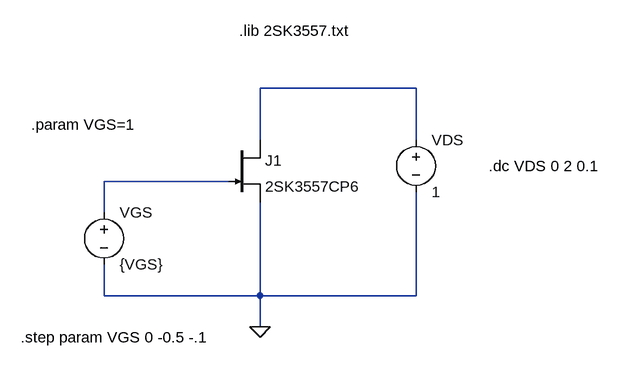
[diagram p0: schematic njfet_2sk3557.asc]
njfet_2sk3557.asc, the LTspice schematic file:
Version 4
SHEET 1 1024 680
WIRE 432 -16 192 -16
WIRE 192 64 192 -16
WIRE 432 64 432 -16
WIRE 144 128 -48 128
WIRE -48 176 -48 128
WIRE -48 304 -48 256
WIRE 192 304 192 160
WIRE 192 304 -48 304
WIRE 432 304 432 144
WIRE 432 304 192 304
WIRE 192 352 192 304
FLAG 192 352 0
SYMBOL voltage -48 160 R0
SYMATTR InstName VGS
SYMATTR Value {VGS}
SYMBOL voltage 432 48 R0
SYMATTR InstName VDS
SYMATTR Value 1
SYMBOL njf 144 64 R0
SYMATTR InstName J1
SYMATTR Value 2SK3557CP6
SYMATTR Prefix X
TEXT 160 -104 Left 2 !.lib 2SK3557.txt
TEXT 544 104 Left 2 !.dc VDS 0 2 0.1
TEXT -160 40 Left 2 !.param VGS=1
TEXT -176 368 Left 2 !.step param VGS 0 -0.5 -.1

The netlist it stands for:
* njfet_2sk3557.asc
VGS N002 0 {VGS}
VDS N001 0 1
XJ1 N001 N002 0 2SK3557CP6  ; pins D G S
.lib 2SK3557.txt
.dc VDS 0 2 0.1
.param VGS=1
.step param VGS 0 -0.5 -.1
.backanno
.end